# EAGLE schematic aw_401_powersupply (EAGLE 6.4)
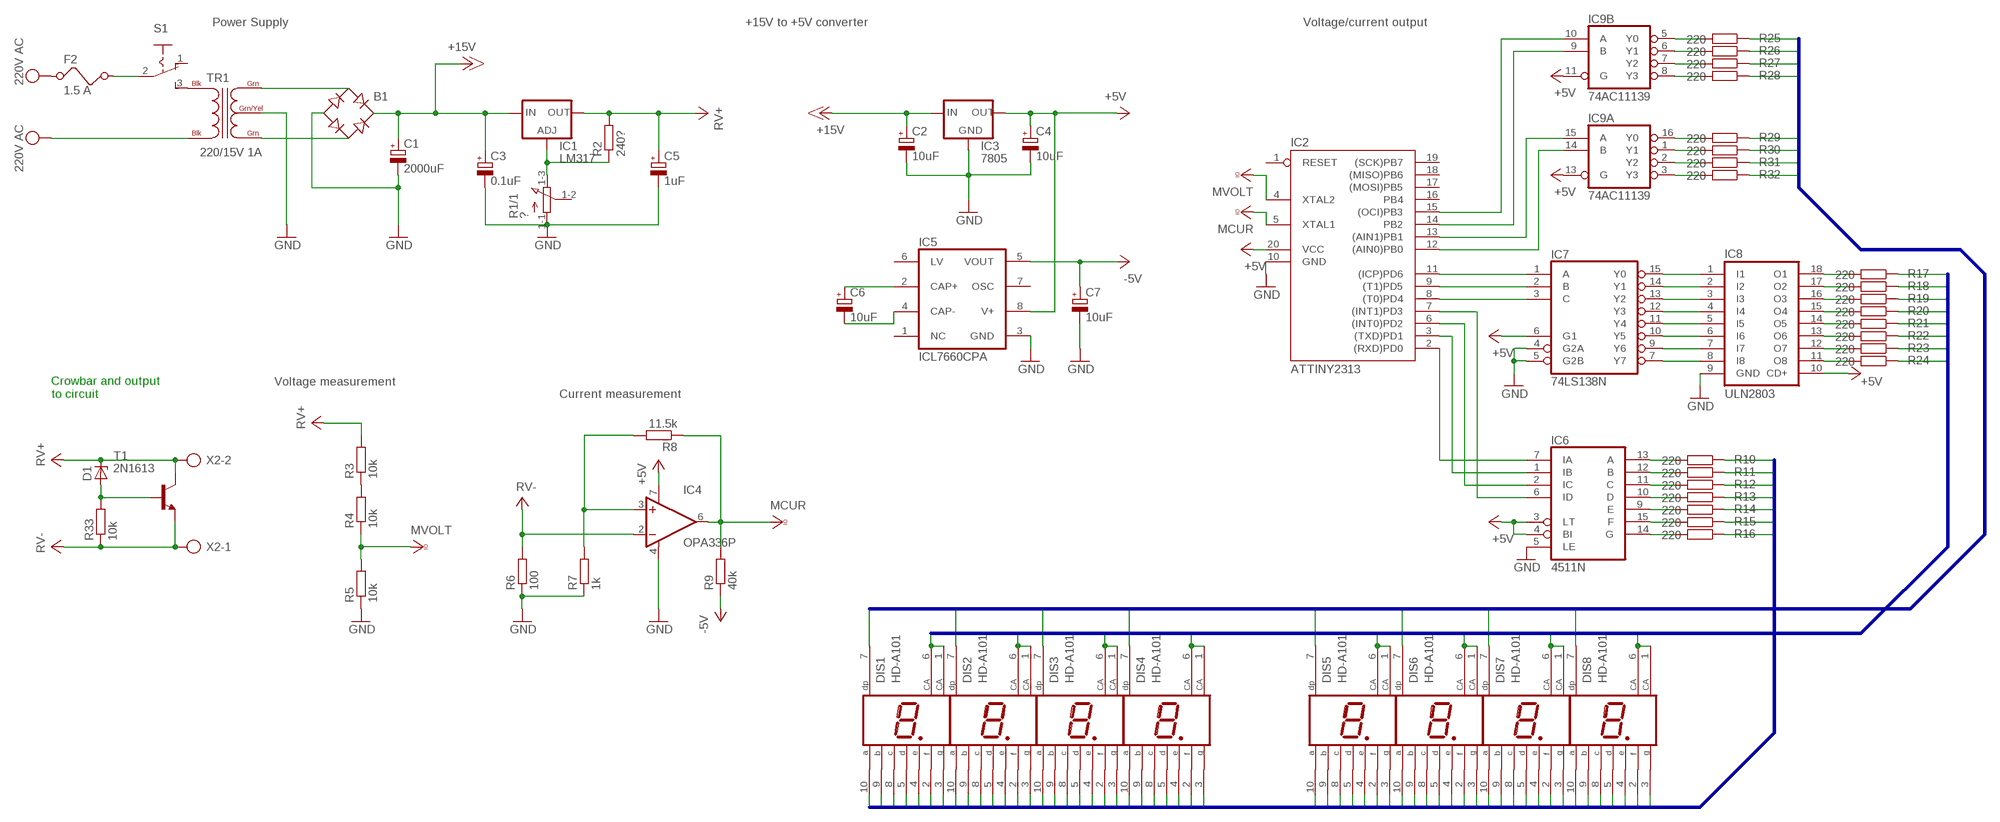
[diagram p0: schematic, sheet 1]

## Parts
B1  RB1A  [RB1A]
C1  2000uF  CPOL-EUE3.5-8  [E3,5-8]
C2  10uF  CPOL-EUE2.5-6  [E2,5-6]
C3  0.1uF  CPOL-EUE2.5-6  [E2,5-6]
C4  10uF  CPOL-EUE2.5-6  [E2,5-6]
C5  1uF  CPOL-EUE2.5-6  [E2,5-6]
C6  10uF  CPOL-EUE2.5-6  [E2,5-6]
C7  10uF  CPOL-EUE2.5-6  [E2,5-6]
D1  ZENER-DIODEC1702-15  [C1702-15]
DIS1  HD-A101  [HDSP-A]
DIS2  HD-A101  [HDSP-A]
DIS3  HD-A101  [HDSP-A]
DIS4  HD-A101  [HDSP-A]
DIS5  HD-A101  [HDSP-A]
DIS6  HD-A101  [HDSP-A]
DIS7  HD-A101  [HDSP-A]
DIS8  HD-A101  [HDSP-A]
F2  1.5 A  FUSE  [FUSE]
IC1  LM317  LM317TS  [317TS]
IC2  ATTINY2313  AT90S2313P  [DIL20]
IC3  7805  78XXS  [78XXS]
IC4  OPA336P  [DIL08]
IC5  ICL7660CPA  [DIL08]
IC6  4511N  [DIL16]
IC7  74LS138N  [DIL16]
IC8  ULN2803  ULN2803A  [DIL18]
IC9  74AC11139  [DIL16]
R1  ?  3RP/1610G  [3RP/1610G]
R2  240?  R-EU_0207/10  [0207/10]
R3  10k  R-EU_0207/10  [0207/10]
R4  10k  R-EU_0207/10  [0207/10]
R5  10k  R-EU_0207/10  [0207/10]
R6  100  R-EU_0207/10  [0207/10]
R7  1k  R-EU_0207/10  [0207/10]
R8  11.5k  R-EU_0207/10  [0207/10]
R9  40k  R-EU_0207/10  [0207/10]
R10  220  R-EU_0207/10  [0207/10]
R11  220  R-EU_0207/10  [0207/10]
R12  220  R-EU_0207/10  [0207/10]
R13  220  R-EU_0207/10  [0207/10]
R14  220  R-EU_0207/10  [0207/10]
R15  220  R-EU_0207/10  [0207/10]
R16  220  R-EU_0207/10  [0207/10]
R17  220  R-EU_0207/10  [0207/10]
R18  220  R-EU_0207/10  [0207/10]
R19  220  R-EU_0207/10  [0207/10]
R20  220  R-EU_0207/10  [0207/10]
R21  220  R-EU_0207/10  [0207/10]
R22  220  R-EU_0207/10  [0207/10]
R23  220  R-EU_0207/10  [0207/10]
R24  220  R-EU_0207/10  [0207/10]
R25  220  R-EU_0207/10  [0207/10]
R26  220  R-EU_0207/10  [0207/10]
R27  220  R-EU_0207/10  [0207/10]
R28  220  R-EU_0207/10  [0207/10]
R29  220  R-EU_0207/10  [0207/10]
R30  220  R-EU_0207/10  [0207/10]
R31  220  R-EU_0207/10  [0207/10]
R32  220  R-EU_0207/10  [0207/10]
R33  10k  R-EU_0207/10  [0207/10]
S1  255SB  [255SB]
T1  2N1613  [TO5]
TR1  220/15V 1A  166A24  [C2H]
X2  AK500/2  [AK500/2]

## Nets
+5V: C4.+ IC2.20(VCC) IC3.OUT IC4.7(V+) IC5.8(V+) IC6.3(LT) IC6.4(BI) IC7.6(G1) IC8.10(CD+) IC9.11(B:G) IC9.13(A:G)
+15V: B1.+ C1.+ C2.+ C3.+ IC1.3(IN) IC3.IN
-5V: C7.+ IC5.5(VOUT) R9.1
ANODE1: DIS8.1(CA) DIS8.6(CA) R17.1
ANODE2: DIS7.1(CA) DIS7.6(CA) R18.1
ANODE3: DIS6.1(CA) DIS6.6(CA) R19.1
ANODE4: DIS5.1(CA) DIS5.6(CA) R20.1
ANODE5: DIS4.1(CA) DIS4.6(CA) R21.1
ANODE6: DIS3.1(CA) DIS3.6(CA) R22.1
ANODE7: DIS2.1(CA) DIS2.6(CA) R23.1
ANODE8: DIS1.1(CA) DIS1.6(CA) R24.1
DP1: DIS1.7(DP) R32.1
DP2: DIS2.7(DP) R31.1
DP3: DIS3.7(DP) R30.1
DP4: DIS4.7(DP) R29.1
DP5: DIS5.7(DP) R28.1
DP6: DIS6.7(DP) R27.1
DP7: DIS7.7(DP) R26.1
DP8: DIS8.7(DP) R25.1
GND: B1.- C1.- C2.- C3.- C4.- C5.- C7.- IC2.10(GND) IC3.GND IC4.4(V-) IC5.3(GND) IC6.5(LE) IC7.4(G2A) IC7.5(G2B) IC8.9(GND) R1.1-1(/1:A) R5.1 R6.1 R7.1 TR1.GRN/YEL
N$1: B1.AC1 TR1.GRN@1(GRN)
N$2: B1.AC2 TR1.GRN@2(GRN)
N$3: D1.A R33.2 T1.2(B)
N$4: C6.+ IC5.2(CAP+)
N$5: R3.1 R4.2
N$6: IC1.1(ADJ) R1.1-3(/1:E) R2.1
N$7: IC4.3(+IN) R7.2 R8.2
N$8: C6.- IC5.4(CAP-)
N$9: IC2.2((RXD)PD0) IC6.7(IA)
N$10: IC2.3((TXD)PD1) IC6.1(IB)
N$11: IC2.6((INT0)PD2) IC6.2(IC)
N$12: IC2.7((INT1)PD3) IC6.6(ID)
N$13: IC6.13(A) R10.2
N$14: IC6.12(B) R11.2
N$15: IC6.11(C) R12.2
N$16: IC6.10(D) R13.2
N$17: IC6.9(E) R14.2
N$18: IC6.15(F) R15.2
N$19: IC6.14(G) R16.2
N$20: IC2.11((ICP)PD6) IC7.1(A)
N$21: IC2.9((T1)PD5) IC7.2(B)
N$22: IC2.8((T0)PD4) IC7.3(C)
N$23: IC7.15(Y0) IC8.1(I1)
N$24: IC7.14(Y1) IC8.2(I2)
N$25: IC7.13(Y2) IC8.3(I3)
N$26: IC7.12(Y3) IC8.4(I4)
N$27: IC9.5(B:Y0) R25.2
N$28: IC9.3(A:Y3) R32.2
N$29: IC9.2(A:Y2) R31.2
N$30: IC9.1(A:Y1) R30.2
N$31: IC9.16(A:Y0) R29.2
N$32: IC9.8(B:Y3) R28.2
N$33: IC9.7(B:Y2) R27.2
N$34: IC7.11(Y4) IC8.5(I5)
N$35: IC7.10(Y5) IC8.6(I6)
N$36: IC7.9(Y6) IC8.7(I7)
N$37: IC7.7(Y7) IC8.8(I8)
N$38: IC9.6(B:Y1) R26.2
N$39: S1.3(S) TR1.BLK@1(BLK)
N$40: F2.2 S1.2(P)
N$46: IC8.18(O1) R17.2
N$47: IC8.17(O2) R18.2
N$48: IC8.16(O3) R19.2
N$49: IC8.15(O4) R20.2
N$50: IC8.14(O5) R21.2
N$51: IC8.13(O6) R22.2
N$52: IC8.12(O7) R23.2
N$53: IC8.11(O8) R24.2
N$54: IC2.12((AIN0)PB0) IC9.14(A:B)
N$55: IC2.13((AIN1)PB1) IC9.15(A:A)
N$56: IC2.14(PB2) IC9.9(B:B)
N$57: IC2.15((OCI)PB3) IC9.10(B:A)
PORT0: DIS1.10(A) R10.1
PORT1: DIS1.9(B) R11.1
PORT2: DIS1.8(C) R12.1
PORT3: DIS1.5(D) R13.1
PORT4: DIS1.4(E) R14.1
PORT5: DIS1.2(F) R15.1
PORT6: DIS1.3(G) R16.1
V+: C5.+ D1.C IC1.2(OUT) IC4.2(-IN) R2.2 R3.2 R6.2 R33.1 T1.1(E) T1.3(C) X2.1 X2.2 ; supply symbol labelled RV+, RV-
VCCIO: IC2.4(XTAL2) IC2.5(XTAL1) IC4.6(OUT) R4.1 R5.2 R8.1 R9.2 ; supply symbol labelled MVOLT, MCUR
VDD: F2.1 TR1.BLK@2(BLK) ; supply symbol labelled 220V AC
Unconnected: DIS2.2(F) DIS2.3(G) DIS2.4(E) DIS2.5(D) DIS2.8(C) DIS2.9(B) DIS2.10(A) DIS3.2(F) DIS3.3(G) DIS3.4(E) DIS3.5(D) DIS3.8(C) DIS3.9(B) DIS3.10(A) DIS4.2(F) DIS4.3(G) DIS4.4(E) DIS4.5(D) DIS4.8(C) DIS4.9(B) DIS4.10(A) DIS5.2(F) DIS5.3(G) DIS5.4(E) DIS5.5(D) DIS5.8(C) DIS5.9(B) DIS5.10(A) DIS6.2(F) DIS6.3(G) DIS6.4(E) DIS6.5(D) DIS6.8(C) DIS6.9(B) DIS6.10(A) DIS7.2(F) DIS7.3(G) DIS7.4(E) DIS7.5(D) DIS7.8(C) DIS7.9(B) DIS7.10(A) DIS8.2(F) DIS8.3(G) DIS8.4(E) DIS8.5(D) DIS8.8(C) DIS8.9(B) DIS8.10(A) IC2.1(RESET) IC2.16(PB4) IC2.17((MOSI)PB5) IC2.18((MISO)PB6) IC2.19((SCK)PB7) IC5.1(NC) IC5.6(LV) IC5.7(OSC) R1.1-2(/1:S) R1.2-1(/2:A) R1.2-2(/2:S) R1.2-3(/2:E) S1.1(O)

## Buses
DIGIT[0..6]
ANODE[1..8]
DP[1..8]

## Notes on the sheet
- Power Supply | +15V to +5V converter | Voltage/current output
- Voltage measurement
- Crowbar and output
  to circuit
- Current measurement

## Power pins joined to a net without a drawn wire
GND: IC7.8(GND) IC9.4(P:GND)
VCC: IC7.16(VCC) IC9.12(P:VCC)
VDD: IC6.16(VDD)
VSS: IC6.8(VSS)

## Library data of the parts
B1 = rectifier:RB1A: RECTIFIER 1 A
C1-C7 = resistor:CPOL-EU: POLARIZED CAPACITOR, European symbol
D1 = diode:ZENER-DIODE: Z-Diode
DIS1-DIS8 = display-hp:HD-A101: LED DISPLAY 1-character 7 segment, decimal point right; OC_FARNELL: unknown; OC_NEWARK: unknown
F2 = special:FUSE: FUSE 5 x 20 mm
IC1 = v-reg:LM317TS: VOLTAGE REGULATOR
IC2 = atmel:AT90S2313: MICROCONTROLLER 2 Kbytes FLASH 128 bytes SRAM 128 bytes EEPROM UART; OC_FARNELL: unknown; OC_NEWARK: unknown
IC3 = v-reg:78XXS: VOLTAGE REGULATOR
IC4 = burr-brown:OPA336: CMOS Operational Amplifiers Single-Supply, MicroPower, MicroAmplifier(TM) Series; OC_FARNELL: unknown; OC_NEWARK: unknown
IC5 = maxim:ICL7660CPA: VOLTAGE CONVERTER; MF: INTERSIL; MPN: ICL7660CPA; OC_FARNELL: 1018170; OC_NEWARK: 06F7441
IC6 = 45xx:4511: BCD to 7-segment LATCH/DECODER/DRIVER
IC7 = 74xx-eu:74*138: 3-line to 8-line DECODER/DEMULTIPLEXER
IC8 = uln-udn:ULN2803A: DRIVER ARRAY
IC9 = 74ac-logic:74AC11139: Dual 2 to 4 line DECODER/DEMULTIPLEXER
R1 = pot:3RP/1610G: 16mm Potentiometer two level Source: http://www.alphapotentiometers.net/html/16mm_pot_2.html
R2-R33 = rcl:R-EU_: RESISTOR, European symbol
S1 = switch:255SB: SLIDING SWITCH Distributor Buerklin, 11G810
T1 = transistor:2N1613: NPN TRANSISTOR
TR1 = trafo-hammondmfg:166: OPEN STYLE FILAMENT & L.V. RECTIFIER USE TRANSFORMERS Economical single primnary 115VAC, 60 Hz or 117 VAC 50/60 Hz Source: Data sheet <http://www.hammondmfg.com/166.htm>
X2 = con-ptr500:AK500/2: CONNECTOR; OC_FARNELL: unknown; OC_NEWARK: unknown